# EAGLE design Escorna_CPU_1_20 (EAGLE 6.4)
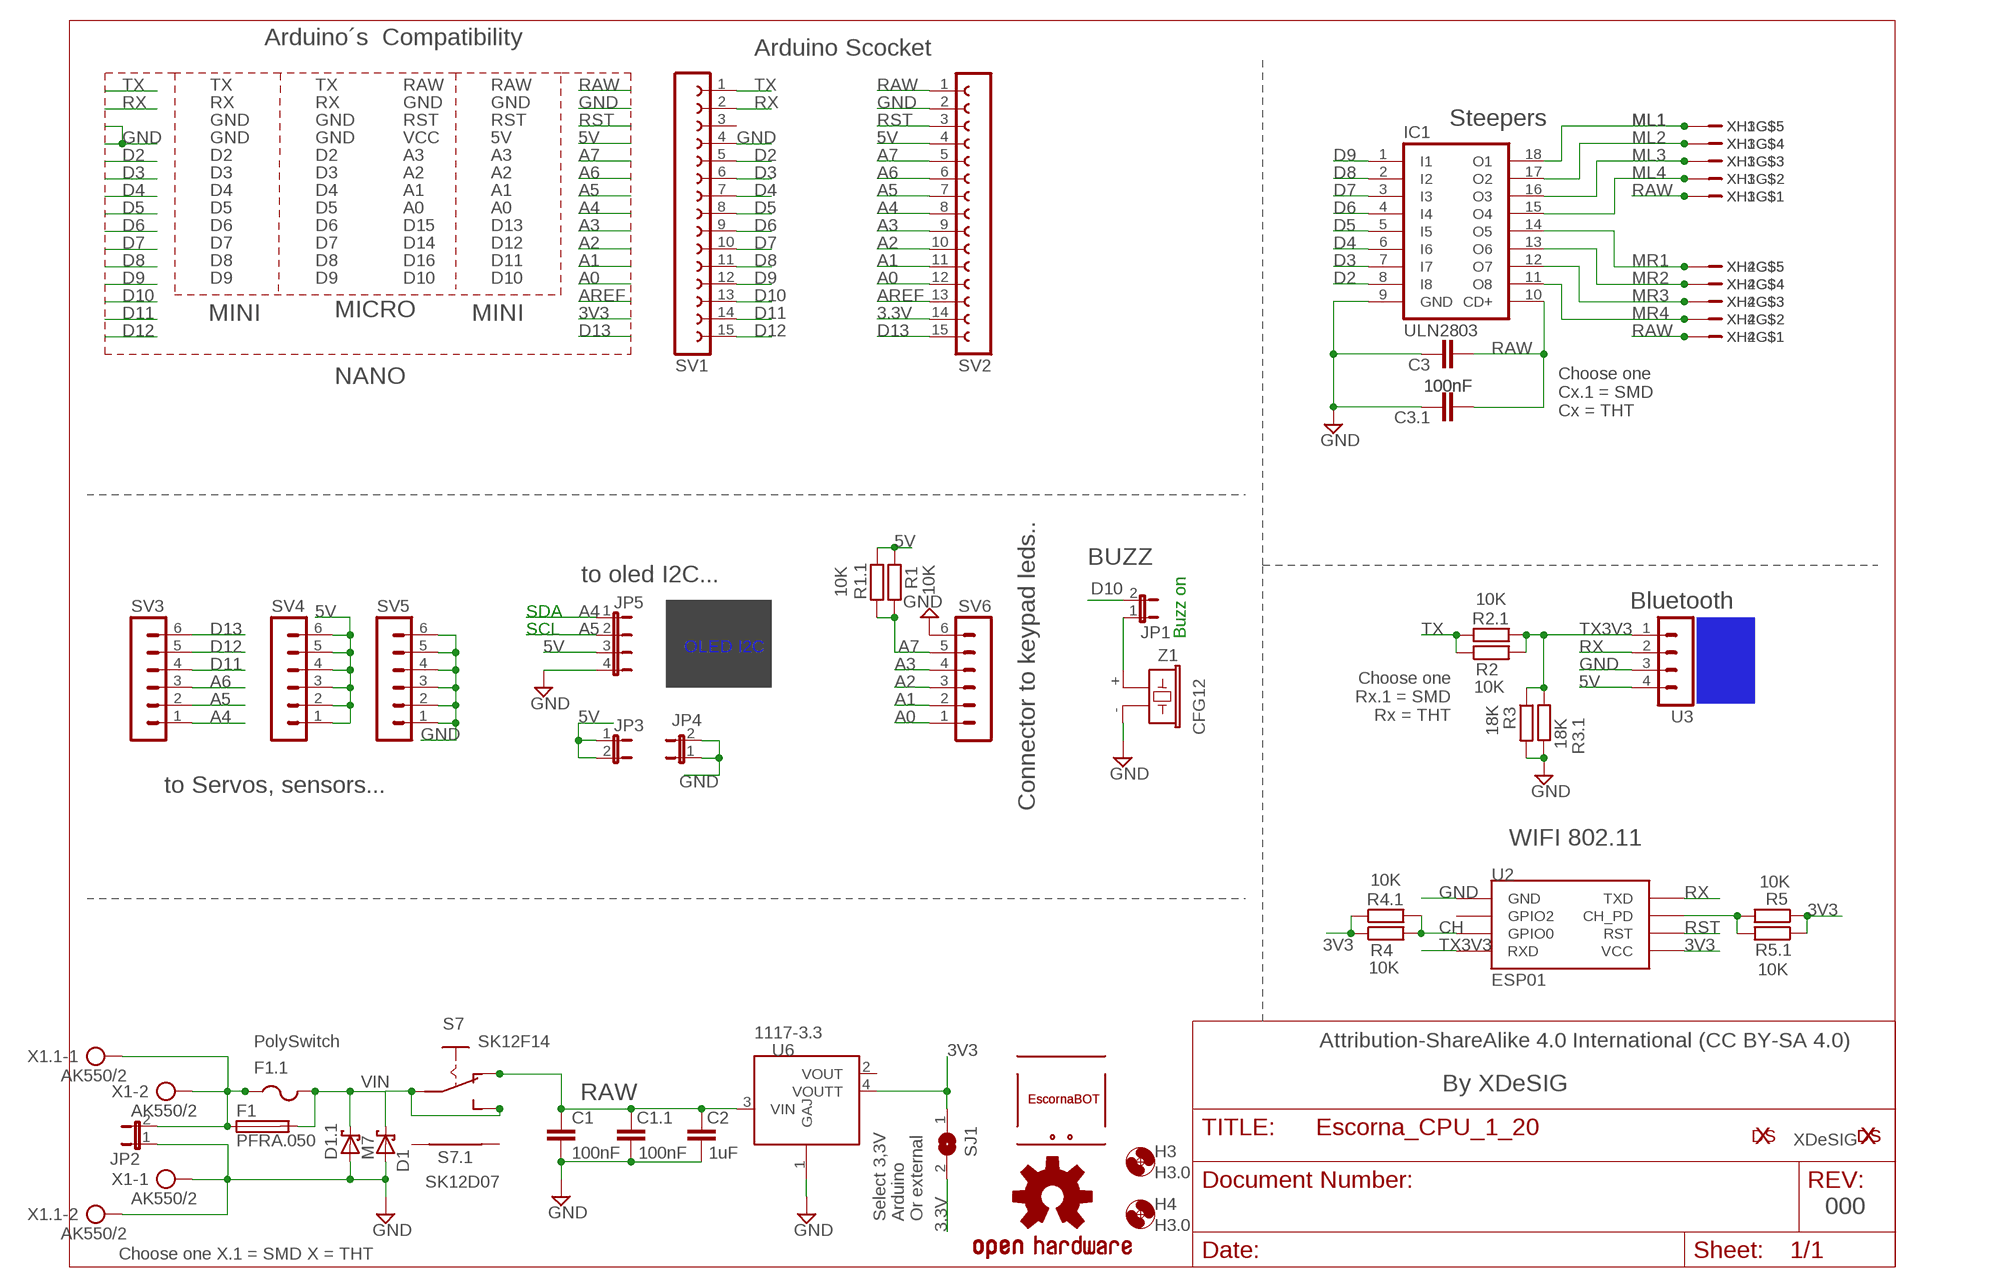
[diagram p0: schematic, sheet 1]

## Parts
C1  100nF  C-EU025-025X050  [C025-025X050]
C1.1  100nF  C-EUC0603K  [C0603K]
C2  1uF  C-EUC1206K  [C1206K]
C3  100nF  C-EU025-025X050  [C025-025X050]
C3.1  100nF  C-EUC0603K  [C0603K]
D1  1N5817  P4KEXX  [DO41-10]
D1.1  M7  SCHOTTKY-DIODE  [SMA-DO214AC]
ESC1  ESCORNABOT  [ESCORNA_PEQUE]
ESC2  ESCORNABOT  [ESCORNA_PEQUE]
F1  PFRA.050  FUSETE5  [TE5]
F1.1  PolySwitch  PTCFUSE-1206  [R1206]
H3  H3.0  MOUNT-HOLE3.0  [3,0]
H4  H3.0  MOUNT-HOLE3.0  [3,0]
IC1  ULN2803  ULN2803A  [DIL18]
JP1  JP1E  [1X02]
JP2  JP1E  [1X02]
JP3  JP1E  [JP1]
JP4  JP1E  [JP1]
JP5  JP4E  [JP4]
LOGO2  OSHW-LOGOS  [OSHW-LOGO-S]
R1  10K  R-EU_0204/7  [0204/7]
R1.1  10K  R-EU_R0603  [R0603]
R2  10K  R-EU_0204/7  [0204/7]
R2.1  10K  R-EU_R0603  [R0603]
R3  18K  R-EU_0204/7  [0204/7]
R3.1  18K  R-EU_R0603  [R0603]
R4  10K  R-EU_0204/7  [0204/7]
R4.1  10K  R-EU_R0603  [R0603]
R5  10K  R-EU_0204/7  [0204/7]
R5.1  10K  R-EU_R0603  [R0603]
S7  SK12F14  ESCORNA_SK12F14F  [ESCORNA_SK-12F14-G]
S7.1  SK12D07  ESCORNA_SK12F14D  [ESCORNA_SK-12D07]
SJ1  SJ  [SJ]
SV1  1x15 SOCKET STRIP  CON-LSTA_FE15-1  [CON-LSTA_FE15]
SV2  1x15 SOCKET STRIP  CON-LSTA_FE15-1  [CON-LSTA_FE15]
SV3  MA06-1  [MA06-1]
SV4  MA06-1  [MA06-1]
SV5  MA06-1  [MA06-1]
SV6  MA06-1  [MA06-1]
U2  ESP01  [ESP01]
U3  MA04-1  [MA04-1]
U6  1117-3.3  ASM1117-3.3  [SOT223]
U$1  XDESIG_XDESIG21  [XDESIG_XDESIG]
U$13  XDESIG_XDESIG21  [XDESIG_XDESIG]
X1  AK550/2  [AK550/2]
X1.1  AK550/2  [AK550/2]
XDS1  XDESIG  [XDESIG_CU_2]
XH1  B5B-XH-A  [B5B-XH-A]
XH2  B5B-XH-A  [B5B-XH-A]
XH3  B5B-XH-A  [B5B-XH-A]
XH4  B5B-XH-A  [B5B-XH-A]
Z1  CFG12  F/CM12P  [F/CM12P]

## Nets
3.3V: SJ1.2 SV2.14
3V3: R4.1 R4.1.1 R5.1 R5.1.1 SJ1.1 U2.VCC U6.4(VOUTT)
5V: JP3.1 JP3.2 JP5.3 R1.1 R1.1.1 SV2.4 SV4.1 SV4.2 SV4.3 SV4.4 SV4.5 SV4.6 U3.4
A0: SV2.12 SV6.1
A1: SV2.11 SV6.2
A2: SV2.10 SV6.3
A3: SV2.9 SV6.4
A4: JP5.1 SV2.8 SV3.1
A5: JP5.2 SV2.7 SV3.2
A6: SV2.6 SV3.3
A7: R1.1.2 R1.2 SV2.5 SV6.5
AREF: SV2.13
CH: R4.1.2 R4.2 U2.GPIO0
D2: IC1.8(I8) SV1.5
D3: IC1.7(I7) SV1.6
D4: IC1.6(I6) SV1.7
D5: IC1.5(I5) SV1.8
D6: IC1.4(I4) SV1.9
D7: IC1.3(I3) SV1.10
D8: IC1.2(I2) SV1.11
D9: IC1.1(I1) SV1.12
D10: JP1.2 SV1.13
D11: SV1.14 SV3.4
D12: SV1.15 SV3.5
D13: SV2.15 SV3.6
GND: C1.1.1 C1.2 C2.1 C3.1 C3.1.1 D1.1.A D1.A IC1.9(GND) JP2.1 JP4.1 JP4.2 JP5.4 R3.1.1 R3.2 SV1.4 SV2.2 SV5.1 SV5.2 SV5.3 SV5.4 SV5.5 SV5.6 SV6.6 U2.GND U3.3 U6.1(GAJ) X1.1 X1.1.2 Z1.-
ML1: IC1.18(O1) XH1.P$5 XH3.P$5
ML2: IC1.17(O2) XH1.P$4 XH3.P$4
ML3: IC1.16(O3) XH1.P$3 XH3.P$3
ML4: IC1.15(O4) XH1.P$2 XH3.P$2
MR1: IC1.14(O5) XH2.P$5 XH4.P$5
MR2: IC1.13(O6) XH2.P$4 XH4.P$4
MR3: IC1.12(O7) XH2.P$3 XH4.P$3
MR4: IC1.11(O8) XH2.P$2 XH4.P$2
N$1: R5.1.2 R5.2 U2.CH_PD
N$2: JP1.1 Z1.+
N$3: F1.1 F1.1.1 JP2.2 X1.1.1 X1.2
N$10: S7.1.P$4 S7.P$4
N$11: S7.1.P$5 S7.P$5
RAW: C1.1 C1.1.2 C2.2 C3.1.2 C3.2 IC1.10(CD+) S7.1.P$2(O) S7.P$2(O) SV2.1 U6.3(VIN) XH1.P$1 XH2.P$1 XH3.P$1 XH4.P$1
RST: SV2.3 U2.RST
RX: SV1.2 U2.TX(TXD) U3.2
TX: R2.1 R2.1.1 SV1.1
TX3V3: R2.1.2 R2.2 R3.1 R3.1.2 U2.RX(RXD) U3.1
VIN: D1.1.K(C) D1.C F1.1.2 F1.2 S7.1.P$1(P) S7.1.P$3(S) S7.P$1(P) S7.P$3(S)
Unconnected: SV1.3 U2.GPIO2 U6.2(VOUT)

## Notes on the sheet
- Arduino´s  Compatibility
- Arduino Scocket
- TX | TX | RAW | RAW
- RX | RX | GND | GND
- GND | GND | RST | RST | Steepers
- GND | GND | VCC | 5V
- D2 | D2 | A3 | A3
- D3 | D3 | A2 | A2
- D4 | D4 | A1 | A1
- D5 | D5 | A0 | A0
- D6 | D6 | D15 | D13
- D7 | D7 | D14 | D12
- D8 | D8 | D16 | D11
- D9 | D9 | D10 | D10
- MINI | MINI
- MICRO
- NANO
- Choose one
  Cx.1 = SMD
  Cx = THT
- to oled I2C... | BUZZ
- Bluetooth
- SDA
- SCL | Buzz on
- RXD
- OLED I2C
- TXD
- Choose one
  Rx.1 = SMD
  Rx = THT
- GND
- VCC
- to Servos, sensors...
- Connector to keypad leds..
- WIFI 802.11
- Attribution-ShareAlike 4.0 International (CC BY-SA 4.0)
- By XDeSIG
- XDeSIG
- 000
- Select 3,3V
  Arduino
  Or external
- Choose one X.1 = SMD X = THT

## Library data of the parts
C1 C1.1 C2 C3 C3.1 = rcl:C-EU: CAPACITOR, European symbol
D1 = diode:P4KEXX: DIODE transient-voltage suppressor
D1.1 = diode:SCHOTTKY-DIODE: Schottky Diode
ESC1 ESC2 = escorna:ESCORNABOT
F1 = fuse:FUSE: Fuse; OC_FARNELL: unknown; OC_NEWARK: unknown
F1.1 = adafruit:PTCFUSE: PTC fuses, resettable thermistors
H3 H4 = holes:MOUNT-HOLE: MOUNTING HOLE with drill center marker
IC1 = uln-udn:ULN2803A: DRIVER ARRAY
JP1 JP2 = SparkFunEagle-6-6-07:JP1E: Jumper Basic 0.1" spaced jumper. Use with breakaway headers.
JP3 JP4 = jumper:JP1E: JUMPER
JP5 = jumper:JP4E: JUMPER
LOGO2 = SparkFun-Aesthetics:OSHW-LOGO: Open Source Hardware Logo This logo indicates the piece of hardware it is found on incorporates a OSHW license and/or adheres to the definition of open source hardware found here: http://freedomdefined.org/OSHW
R1 R1.1 R2 R2.1 R3 R3.1 R4 R4.1 R5 R5.1 = rcl:R-EU_: RESISTOR, European symbol
S7 S7.1 = escorna_ELIB:ESCORNA_SK12F14
SJ1 = jumper:SJ: SMD solder JUMPER
SV1 SV2 = escorna_LBREscorna_CPU_2_10:CON-LSTA_FE15-1: FEMALE HEADER; OC_FARNELL: unknown; OC_NEWARK: unknown
SV3-SV6 = con-lstb:MA06-1: PIN HEADER; OC_FARNELL: unknown; OC_NEWARK: unknown
U2 = esp8266modules:ESP01: ESP8266 Wifi module 01
U3 = con-lstb:MA04-1: PIN HEADER; OC_FARNELL: unknown; OC_NEWARK: unknown
U6 = Itead_IC_110429:ASM1117-3.3: ICP006
U$1 U$13 = Escorna_CPU_2_01:XDESIG_XDESIG
X1 X1.1 = con-ptr500:AK550/2: CONNECTOR; OC_FARNELL: unknown; OC_NEWARK: unknown
XDS1 = xdesig:XDESIG
XH1-XH4 = con-jst:B5B-XH-A
Z1 = buzzer:F/CM12P: BUZZER Source: Buerklin; OC_FARNELL: unknown; OC_NEWARK: unknown

## Net classes
0 default: width 0.254 mm, drill 0.61 mm, clearance 0.254 mm
1 power: width 0.254 mm, drill 0.61 mm, clearance 0.254 mm

## Board
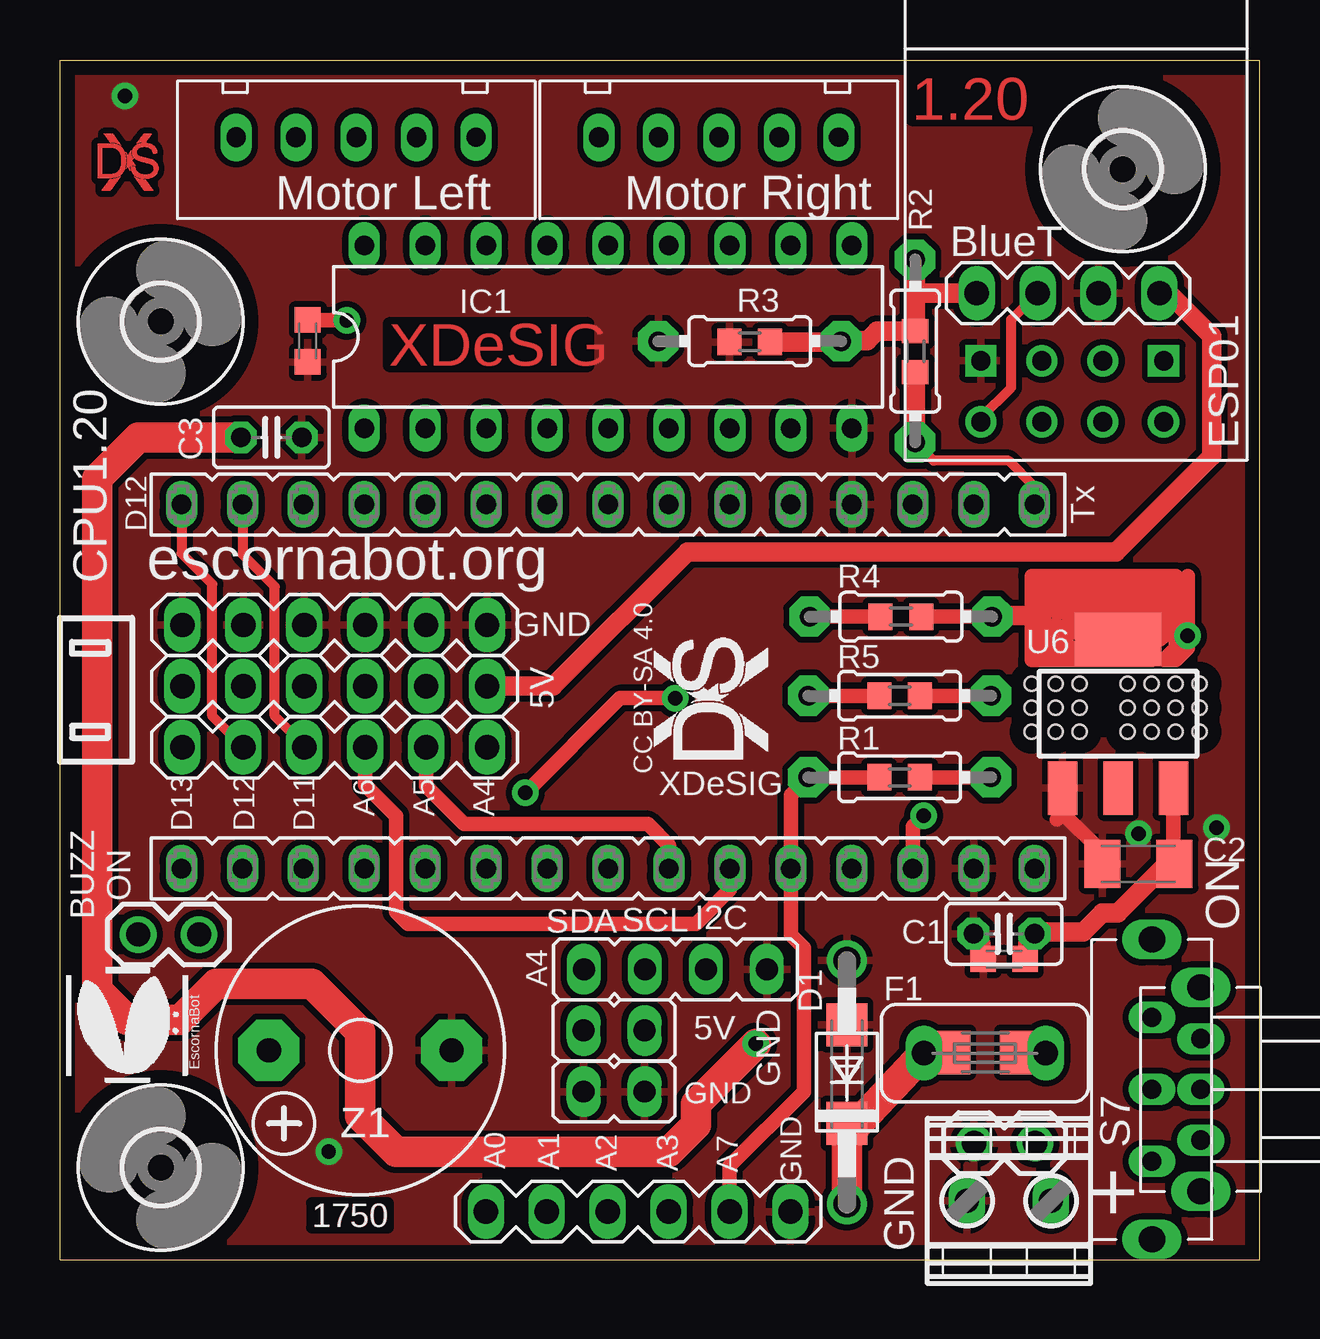
[diagram p1: board, top side]
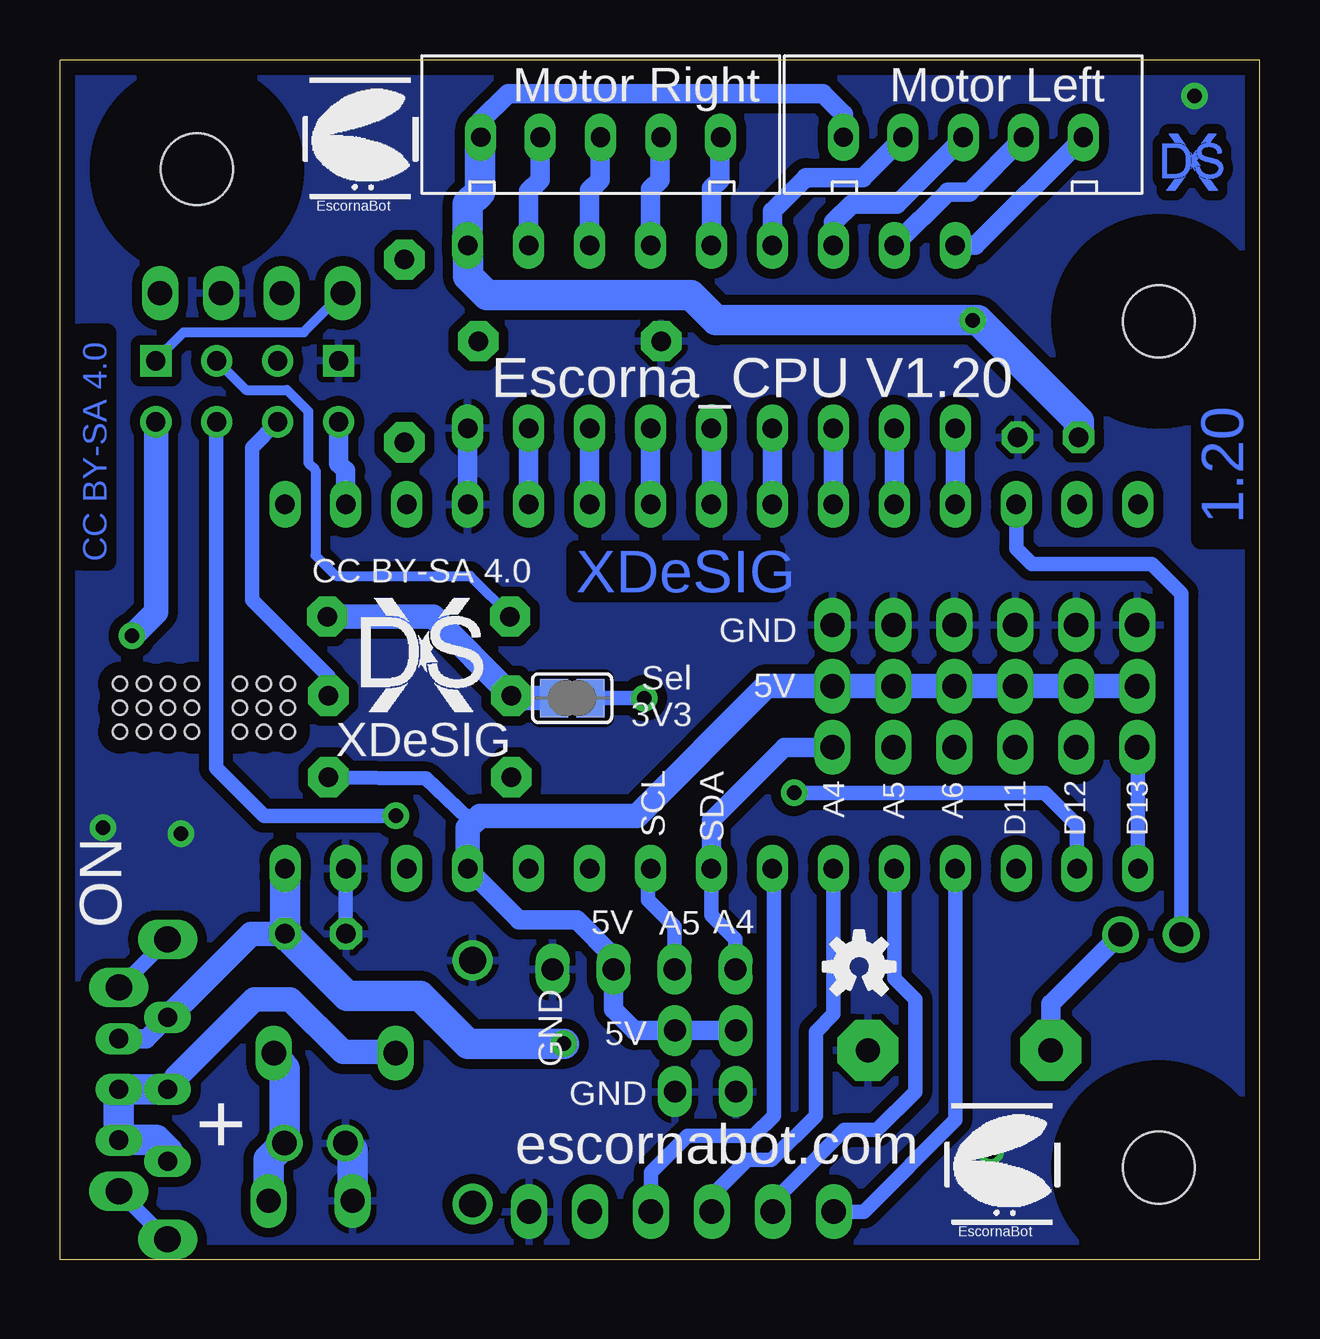
[diagram p2: board, bottom side, seen from below]

Size 50 x 50 mm. Coordinates in mm from the lower left corner, seen from the top.
Outline: 0,50 50,50 50,0 0,0 0,50
Copper layers (1*16): Top 0.035mm / dielectric 1.5mm / Bottom 0.035mm
Design rules "default": minimum track width 10mil, minimum drill 22mil, track to track 10mil, track to pad 10mil, pad to pad 8mil, via to via 12mil, smd to smd 8mil, copper to edge 24mil, drill to drill 12mil, minimum pad ring 10mil, minimum via ring 10mil, stop-mask expansion 2mil, vias tented up to drill 30mil, thermal gap 10mil
Holes 0.6 mm at 41.5,24 41.5,23 41.5,22 44.5,24 44.5,23 44.5,22 45.5,24 46.5,24 47.5,24 47.5,23 46.5,23 45.5,23 45.5,22 46.5,22 47.5,22 42.5,24 42.5,23 42.5,22 40.5,24 40.5,23 40.5,22

### Footprints (pad centres in the part's own frame; a part is rotated, then mirrored left to right if it is on the bottom)
C025-025X050 = drill 0.813 octagon: 1 -1.27,0; 2 1.27,0
C0603K = smd 1.05 x 1.08: 1 -0.875,0; 2 0.875,0
C1206K = smd 1.5 x 2: 1 -1.5,0; 2 1.5,0
DO41-10 = drill 1.118: A 5.08,0; C -5.08,0
SMA-DO214AC = smd 1.8 x 1.7: A -2.05,0; K 2.05,0
TE5 = drill 1.016 long: 1 -2.54,0; 2 2.54,0
R1206 = smd 1.6 x 1.803: 1 -1.422,0; 2 1.422,0
3,0 = hole 3: 0,0
DIL18 = drill 0.813 long: 1 -10.16,-3.81; 2 -7.62,-3.81; 3 -5.08,-3.81; 4 -2.54,-3.81; 5 0,-3.81; 6 2.54,-3.81; 7 5.08,-3.81; 8 7.62,-3.81; 9 10.16,-3.81; 10 10.16,3.81; 11 7.62,3.81; 12 5.08,3.81; 13 2.54,3.81; 14 0,3.81; 15 -2.54,3.81; 16 -5.08,3.81; 17 -7.62,3.81; 18 -10.16,3.81
1X02 = drill 1.016: 1 0,0; 2 2.54,0
JP1 = drill 0.914 long: 1 0,-1.27; 2 0,1.27
JP4 = drill 0.914 long: 1 -3.81,0; 2 -1.27,0; 3 1.27,0; 4 3.81,0
0204/7 = drill 0.813 pad 1.676 octagon: 1 -3.81,0; 2 3.81,0
R0603 = smd 1 x 1.1: 1 -0.85,0; 2 0.85,0
ESCORNA_SK-12F14-G = drill 0.8 long: P$1 0,0; P$2 3,0; P$3 -3,0 | drill 1.1 long: P$4 -6.25,0; P$5 6.25,0
ESCORNA_SK-12D07 = drill 0.8 long: P$1 0,0; P$2 2.115,0; P$3 -2.115,0 | drill 1.1 pad 1.27 long: P$4 -4.25,0; P$5 4.25,0
SJ = smd 1.168 x 1.6: 1 -0.762,0; 2 0.762,0
CON-LSTA_FE15 = drill 0.813 long: 1 -17.78,0; 2 -15.24,0; 3 -12.7,0; 4 -10.16,0; 5 -7.62,0; 6 -5.08,0; 7 -2.54,0; 8 0,0; 9 2.54,0; 10 5.08,0; 11 7.62,0; 12 10.16,0; 13 12.7,0; 14 15.24,0; 15 17.78,0
MA06-1 = drill 1.016 long: 1 -6.35,0; 2 -3.81,0; 3 -1.27,0; 4 1.27,0; 5 3.81,0; 6 6.35,0
ESP01 = drill 0.8: CH_PD -1.285,-8.178; GPIO0 1.255,-5.638; GPIO2 -1.285,-5.638; RST 1.255,-8.178; TX -3.825,-8.178; VCC 3.795,-8.178 | drill 0.8 square: GND -3.825,-5.638; RX 3.795,-5.638
MA04-1 = drill 1.016 long: 1 -3.81,0; 2 -1.27,0; 3 1.27,0; 4 3.81,0
SOT223 = smd 1.219 x 2.235: 1 -2.311,-3.099; 2 0,-3.099; 3 2.311,-3.099 | smd 3.6 x 2.2: 4 0,3.099
AK550/2 = drill 1 pad 1.5 long: 1 -1.75,0; 2 1.75,0
B5B-XH-A = drill 0.8 long: P$1 -5.17,-0.19; P$2 -2.69,-0.175; P$3 -0.175,-0.175; P$4 2.34,-0.175; P$5 4.83,-0.175
F/CM12P = drill 1.016 pad 2.54 octagon: + 3.81,0; - -3.81,0

### Placement (x,y rotation side)
C1  39.35,13.58 180 top
C1.1  39.36,12.52 0 top
C2  44.95,16.5 0 top
C3  8.81,34.27 180 top
C3.1  10.33,38.29 90 top
D1  32.8,7.39 90 top
D1.1  32.8,7.73 270 top
ESC  ESCORNABOT  [ESCORNA_PEQUE]  39.95,44.13 0 bottom
ESC1  13.2,1.38 0 bottom
ESC2  5.4,7.3 90 top
F1  38.55,8.6 180 top
F1.1  38.56,8.63 180 top
H3  44.3,45.45 0 top
H4  4.2,39.1 0 top
H7  MOUNT-HOLE3.0  [3,0]  4.2,3.83 90 top
IC1  22.84,38.46 0 top
JP1  5.8,13.55 180 top
JP2  38.1,4.85 0 top
JP3  23.1,9.55 90 top
JP4  23.1,7 90 top
JP5  25.65,12.1 0 top
LOGO2  16.68,12.21 0 bottom
R1  35,20.1 180 top
R1.1  35,20.1 180 top
R2  35.65,37.87 90 top
R2.1  35.65,37.85 90 top
R3  28.75,38.28 180 top
R3.1  28.75,38.25 0 top
R4  35.05,26.8 180 top
R4.1  35.05,26.8 180 top
R5  35,23.5 0 top
R5.1  35,23.5 0 top
S7  45.52,7.09 90 top
S7.1  47.55,7.09 90 top
SJ1  28.65,23.4 0 bottom
SV1  22.84,31.48 180 top
SV2  22.84,16.3 180 top
SV3  11.45,21.35 180 top
SV4  11.45,23.9 0 top
SV5  11.45,26.45 0 top
SV6  24.1,2 0 top
U2  42.21,43.1 0 top
U3  42.02,40.28 0 top
U6  44.1,22.75 0 top
U$1  29.5,20.85 90 top
U$13  37.43,22.84 0 bottom
X1  39.56,2.44 0 top
X1.1  39.56,2.44 180 top
XDS  XDESIG  [XDESIG_CU_2]  1.57,44.56 0 top
XDS1  4.05,44.56 0 bottom
XH1  12.18,46.97 0 bottom
XH2  27.29,46.97 0 bottom
XH3  12.18,46.59 180 top
XH4  27.29,46.59 180 top
Z1  12.51,8.72 180 top

### Tracks (layer width: path | path; a pad name or v marks a point on that pad's centre or on a via)
3.3V  (via drill 0.6)
  Top 0.61: v25.65,23.4 23.35,23.4 v19.4,19.45
  Bottom 0.61: v19.4,19.45 8.95,19.45 7.6,18.11 SV2.14 | SJ1.2 v25.65,23.4
3V3  (via drill 0.6)
  Top 0.61: R4.1.1 R4.1 | R5.1.1 R5.1 | U6.4 45.85,25.85 46,26 46,28.5 | 46,28.5 40.5,28.5 40.5,25 45.5,25 45.5,28 41,28 41,25.5 45,25.5 45,27.5 41.5,27.5 41.5,27 42.5,27 | 44.5,27 42.5,27 | 42.5,27 42,26.5 42,26 41.5,26.5 41.12,26.12 | 46.85,25.85 46.85,28.35 47,28.5 47,25.5 46.5,25 46,25 46.5,25.5 46.5,28.5 46,28.5
  Top 0.813: 41.4,25.85 41.12,26.12 40.4,26.85 38.91,26.85 R4.1
  Top 1.016: 31.04,23.35 R5.1 | 46.85,25.85 v47,26
  Bottom 1.016: v47,26 46,27 U2.VCC | R4.1 34.45,26.8 31.15,23.5 R5.1 31.09,23.4 SJ1.1
5V
  Top 0.61: R1.1 R1.1.1
  Top 0.813: SV4.6 20.55,23.9 26.15,29.5 44,29.5 48,33.5 48,38.5 46.22,40.28 U3.4
  Bottom 0.61: 33.01,18 33.01,18.4 34.75,20.05 R1.1
  Bottom 0.813: SV2.4 30.86,14.15 28.45,14.15 26.92,12.62 JP5.3 26.92,10.42 26.05,9.55 JP3.1 JP3.2
  Bottom 1.016: SV2.4 33.01,18 32.5,18.5 25.95,18.5 20.55,23.9 SV4.6 SV4.5 SV4.4 SV4.3 SV4.2 SV4.1
A0
  Bottom 0.61: SV2.12 12.68,5.82 16.5,2 SV6.1
A1
  Bottom 0.61: SV6.2 20.29,2.39 19.47,3.21 19.47,3.23 17.3,5.4 15.95,5.4 14.35,7 14.35,10.85 15.22,11.72 SV2.11
A2
  Bottom 0.61: SV6.3 22.83,2.67 21.35,4.15 20.35,4.15 18.5,6 18.5,9.5 17.77,10.24 SV2.10
A3
  Bottom 0.61: SV6.4 25.37,3.63 23.85,5.15 21.1,5.15 20.25,6 20.25,16.25 SV2.9
A4
  Bottom 0.61: SV2.8 22.84,14.35 21.84,13.34 JP5.1
  Bottom 0.813: SV2.8 22.84,18.3 19.8,21.35 SV3.1
A5
  Top 0.61: SV3.2 15.26,19.74 16.85,18.15 24.5,18.15 25.38,17.27 SV2.7
  Bottom 0.61: SV2.7 25.5,16.18 25.5,15 24.38,13.88 JP5.2
A6
  Top 0.61: SV2.6 27.92,15.43 26.5,14 14.5,14 14,14.5 14,18.5 12.72,19.78 SV3.3
A7
  Top 0.61: R1.1.2 R1.2 30.46,19.38 SV2.5 30.46,13.54 31,13 31,7 27.91,3.91 SV6.5
CH
  Top 0.61: R4.1.2 R4.2
  Bottom 0.406: U2.GPIO0 42.25,36.25 40.54,36.25 39.65,35.36 39.65,33.2 39.35,32.9 39.35,29.35 38.5,28.5 32.9,28.5 31.2,26.8 R4.2
D2
  Bottom 0.813: IC1.8 SV1.5
D3
  Bottom 0.813: IC1.7 SV1.6
D4
  Bottom 0.813: IC1.6 SV1.7
D5
  Bottom 0.813: IC1.5 SV1.8
D6
  Bottom 0.813: IC1.4 SV1.9
D7
  Bottom 0.813: IC1.3 SV1.10
D8
  Bottom 0.813: IC1.2 SV1.11
D9
  Bottom 0.813: SV1.12 IC1.1
D10
  Bottom 0.61: JP1.2 3.26,27.76 4.5,29 9.5,29 10.14,29.64 SV1.13
D11
  Top 0.406: SV3.4 10.18,21.42 8.95,22.65 8.95,28.05 7.6,29.39 SV1.14
D12
  Top 0.406: SV3.5 6.35,22.65 6.35,28.15 5.06,29.44 SV1.15
D13
  Bottom 0.61: SV2.15 5.06,21.31 SV3.6
GND  (via drill 0.6)
  Top 0.61: SV2.2 38.08,16.63 | 41.55,18.35 41.8,18.6 | 41.8,18.6 41.8,20.19 U6.1 | C2.1 43.25,17.15 41.8,18.6 | C1.1.1 38.48,13.18 C1.2
  Bottom 0.61: SV2.2 C1.2
  Bottom 0.813: IC1.9 SV1.4
  Bottom 1.27: X1.1 37.81,4.56 JP2.1
  other vias: 11.2,4.5 48.2,18 2.7,48.5 44.95,17.75
  pour Top: 0,50.5 50.5,50.5 50.5,-0.5 0,-0.5
  pour Bottom (isolate 0.406): -0.5,50.5 50.5,50.5 50.5,-0.5 -0.5,-0.5
ML1
  Bottom 0.61: XH3.P$5 XH1.P$5
  Bottom 0.813: IC1.18 11.84,42.27 XH3.P$5
ML2
  Bottom 0.61: XH1.P$4 XH3.P$4
  Bottom 0.813: IC1.17 13,44.5 12.1,44.5 XH3.P$4
ML3
  Bottom 0.61: XH3.P$3 XH1.P$3
  Bottom 0.813: IC1.16 17.77,43.24 17,44 15.12,44 XH3.P$3
ML4
  Bottom 0.61: XH3.P$2 XH1.P$2
  Bottom 0.813: IC1.15 20.3,43.7 18.9,45.1 16.53,45.1 XH3.P$2
MR1
  Bottom 0.61: XH4.P$5 XH2.P$5
  Bottom 0.813: IC1.14 22.84,44.66 22.5,45 22.5,46.72 XH4.P$5
MR2
  Bottom 0.61: XH2.P$4 XH4.P$4
  Bottom 0.813: IC1.13 25.38,44.62 25,45 25,46.71 XH4.P$4
MR3
  Bottom 0.61: XH2.P$3 XH4.P$3
  Bottom 0.813: IC1.12 27.92,44.58 27.5,45 27.5,46.73 XH4.P$3
MR4
  Bottom 0.61: XH2.P$2 XH4.P$2
  Bottom 0.813: IC1.11 30.46,44.53 30,45 30,46.74 XH4.P$2
N$1
  Top 0.61: R5.1.2 R5.2
  Bottom 0.61: U2.CH_PD 42,33.85 42,27.5 38.81,24.31 R5.2
N$2
  Bottom 0.813: Z1.+ 8.7,10.65 JP1.1
N$3
  Top 1.27: F1.1.1 41.11,8.48 F1.1
  Bottom 1.27: X1.2 41.31,4.18 JP2.2 40.64,7.95 F1.1
N$10
  Bottom 0.61: S7.P$4 45.55,0.84 S7.1.P$4
N$11
  Bottom 0.61: S7.1.P$5 47.52,11.34 S7.P$5
RAW  (via drill 0.6)
  Top 0.61: U6.3 46.41,17.26 C2.2 | C1.1.2 40.23,13.2 C1.1 | C3.1.2 11.93,39.17 v11.95,39.15
  Top 0.813: C2.2 46.3,16.65 44.1,14.45 43.45,14.45 42.65,13.65 40.68,13.65 C1.1
  Top 1.27: C3.2 3.27,34.27 1.55,32.55 1.55,11.25 2.8,10 5,10 6.5,11.5 10.5,11.5 12.5,9.5 12.5,6 14,4.5 25.38,4.5 26.5,5.62 26.5,6.5 v29,9
  Bottom 0.61: C1.1 | XH4.P$1 | XH3.P$1
  Bottom 0.813: 32.5,46.74 XH4.P$1 | XH4.P$1 32.46,47.47 31.33,48.6 18.2,48.6 17.35,47.74 XH3.P$1 | S7.1.P$2 46.4,9.21 S7.P$2
  Bottom 1.016: C1.1 42.03,13.58 S7.P$2
  Bottom 1.27: C1.1 SV2.1 | C3.2 7.54,34.94 11.75,39.15 v11.95,39.15 22.65,39.15 23.7,40.2 32.2,40.2 33,41 IC1.10 33.01,43.99 32.5,44.5 32.5,46.74 XH4.P$1 | C1.1 38.03,11 35,11 33,9 v29,9
RST  (via drill 0.6)
  Top 0.61: SV2.3 35.54,18.04 v36,18.5
  Bottom 0.61: v36,18.5 41.5,18.5 43.5,20.5 43.5,34.89 U2.RST
RX
  Top 0.406: U2.TX 38.39,35.09 39.65,36.35 39.65,39.18 U3.2
  Bottom 0.813: SV1.2 38.08,32.88 38.39,33.19 U2.TX
TX
  Top 0.406: SV1.1 40.62,32.23 39.55,33.3 36.41,33.3 R2.1
  Top 0.813: R2.1.1 R2.1
TX3V3
  Top 0.406: 35.87,40.28 35.65,40.5
  Top 0.813: R2.2 35.65,40.5 R2.1.2 34.05,38.7 33.65,38.3 32.58,38.3 R3.1 32.53,38.25 R3.1.2 | 35.87,40.28 U3.1
  Bottom 0.406: U2.RX 46.01,37.49 44.85,38.65 39.84,38.65 U3.1
VIN
  Top 0.61: D1.1.K 33,5.39 33.05,5.45
  Top 1.27: F1.1.2 36.09,8.48 F1.2 33.05,5.45 32.8,5.19 D1.C
  Bottom 0.813: S7.P$1 45.16,7.09
  Bottom 1.016: 45.16,7.09 45.16,7.59 41.9,10.85 40.4,10.85 38.2,8.65 36.06,8.65 F1.2
  Bottom 1.27: S7.P$1 S7.1.P$1 S7.1.P$3 47.53,5 46,5 45.52,4.52 S7.P$3

### Text on the board
Top: 1.20 | XDeSIG | 1750
Bottom: 1.20 | CC BY-SA 4.0 | XDeSIG
tPlace: Motor Left | Motor Right | BlueT | ESP01 | CPU1.20 | D12 | Tx | escornabot.org | GND | CC BY-SA 4.0 | 5V | D13 | D12 | D11 | A6 | A5 | A4 | XDeSIG | BUZZ / ON | SDA | SCL | I2C | ON | A4 | GND | 5V | GND | GND | A0 | A1 | A2 | A3 | A7 | + | 1750 | GND
bPlace: Motor Left | Motor Right | Escorna_CPU V1.20 | CC BY-SA 4.0 | GND | Sel / 3V3 | 5V | XDeSIG | SDA | SCL | D13 | D12 | D11 | A6 | A5 | A4 | A4 | A5 | 5V | ON | 5V | GND | GND | + | escornabot.com
Measures: Attribution-ShareAlike 4.0 International (CC BY-SA 4.0)